# Altium schematic sheet Sheet1.SchDoc
size A
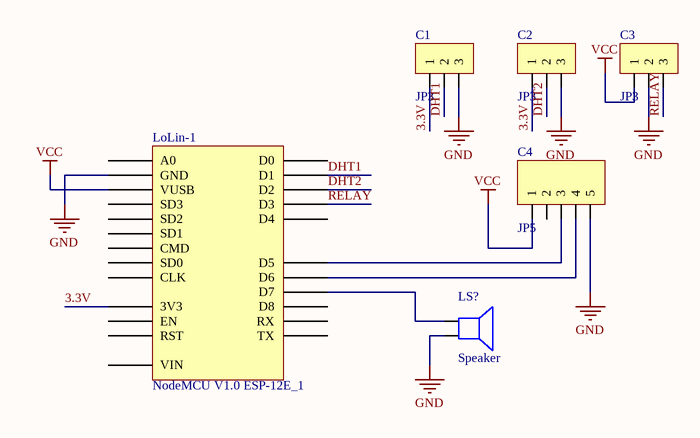
[diagram p0: Sheet1.SchDoc]

## Parts
C1  JP3  [JP3-C1T]
C2  JP3  [JP3-C1T]
C3  JP3  [JP3-C1T]
C4  JP5  [JP5-C1T]
LoLin-1  NodeMCU V1.0 ESP-12E_1  [LoLin NodeMcu V3]
LS?  Speaker  [SPEAKER]

## Nets
GND: C1.3 C2.3 C3.2 C4.5 LoLin-1.GND LS?.2
VCC: C3.1 C4.1 LoLin-1.VUSB
3.3V: C1.1 C2.1 LoLin-1.3V3
DHT1: C1.2 LoLin-1.D1
DHT2: C2.2 LoLin-1.D2
RELAY: C3.3 LoLin-1.D3
NetC4_3: C4.3 LoLin-1.D5
NetC4_4: C4.4 LoLin-1.D6
NetLoLin-1_D7: LoLin-1.D7 LS?.1

Not connected (* = marked no-connect by the designer): C4 2; LoLin-1 A0 CLK CMD D0 D4 D8 EN RST RX SD0 SD1 SD2 SD3 TX VIN

## Library data of the parts
C1-C3 = JP3: WR-PHD 2.54 mm Angled Socket Header; Manufacturer: W¨¹rth Elektronik eiSos GmbH; partNo: 613003143121; ComponentLink1 Description: Manufacturer; ComponentLink2 Description: Datasheet; NoPins: 03; Created Date: 29 March 2013; ComponentLink1URL: http://www.we-online.com; ComponentLink2URL: http://katalog.we-online.de/em/datasheet/6130xx143121.pdf; Created by: Karrer Zheng
C4 = JP5: WR-PHD 2.54 mm Angled Socket Header; Manufacturer: W¨¹rth Elektronik eiSos GmbH; partNo: 613005143121; ComponentLink1 Description: Manufacturer; ComponentLink2 Description: Datasheet; NoPins: 05; Created Date: 29 March 2013; ComponentLink1URL: http://www.we-online.com; ComponentLink2URL: http://katalog.we-online.de/em/datasheet/6130xx143121.pdf; Created by: Karrer Zheng
LoLin-1 = NodeMCU V1.0 ESP-12E_1: LoLin NodeMCU V3
LS? = Speaker: Loudspeaker; Published: 24-Mar-1999; LatestRevisionDate: 17-Jul-2002; LatestRevisionNote: Re-released for DXP Platform.; PackageReference: PIN2; Publisher: Altium Limited